# EAGLE design T04_Schematic (EAGLE 7.4.0)
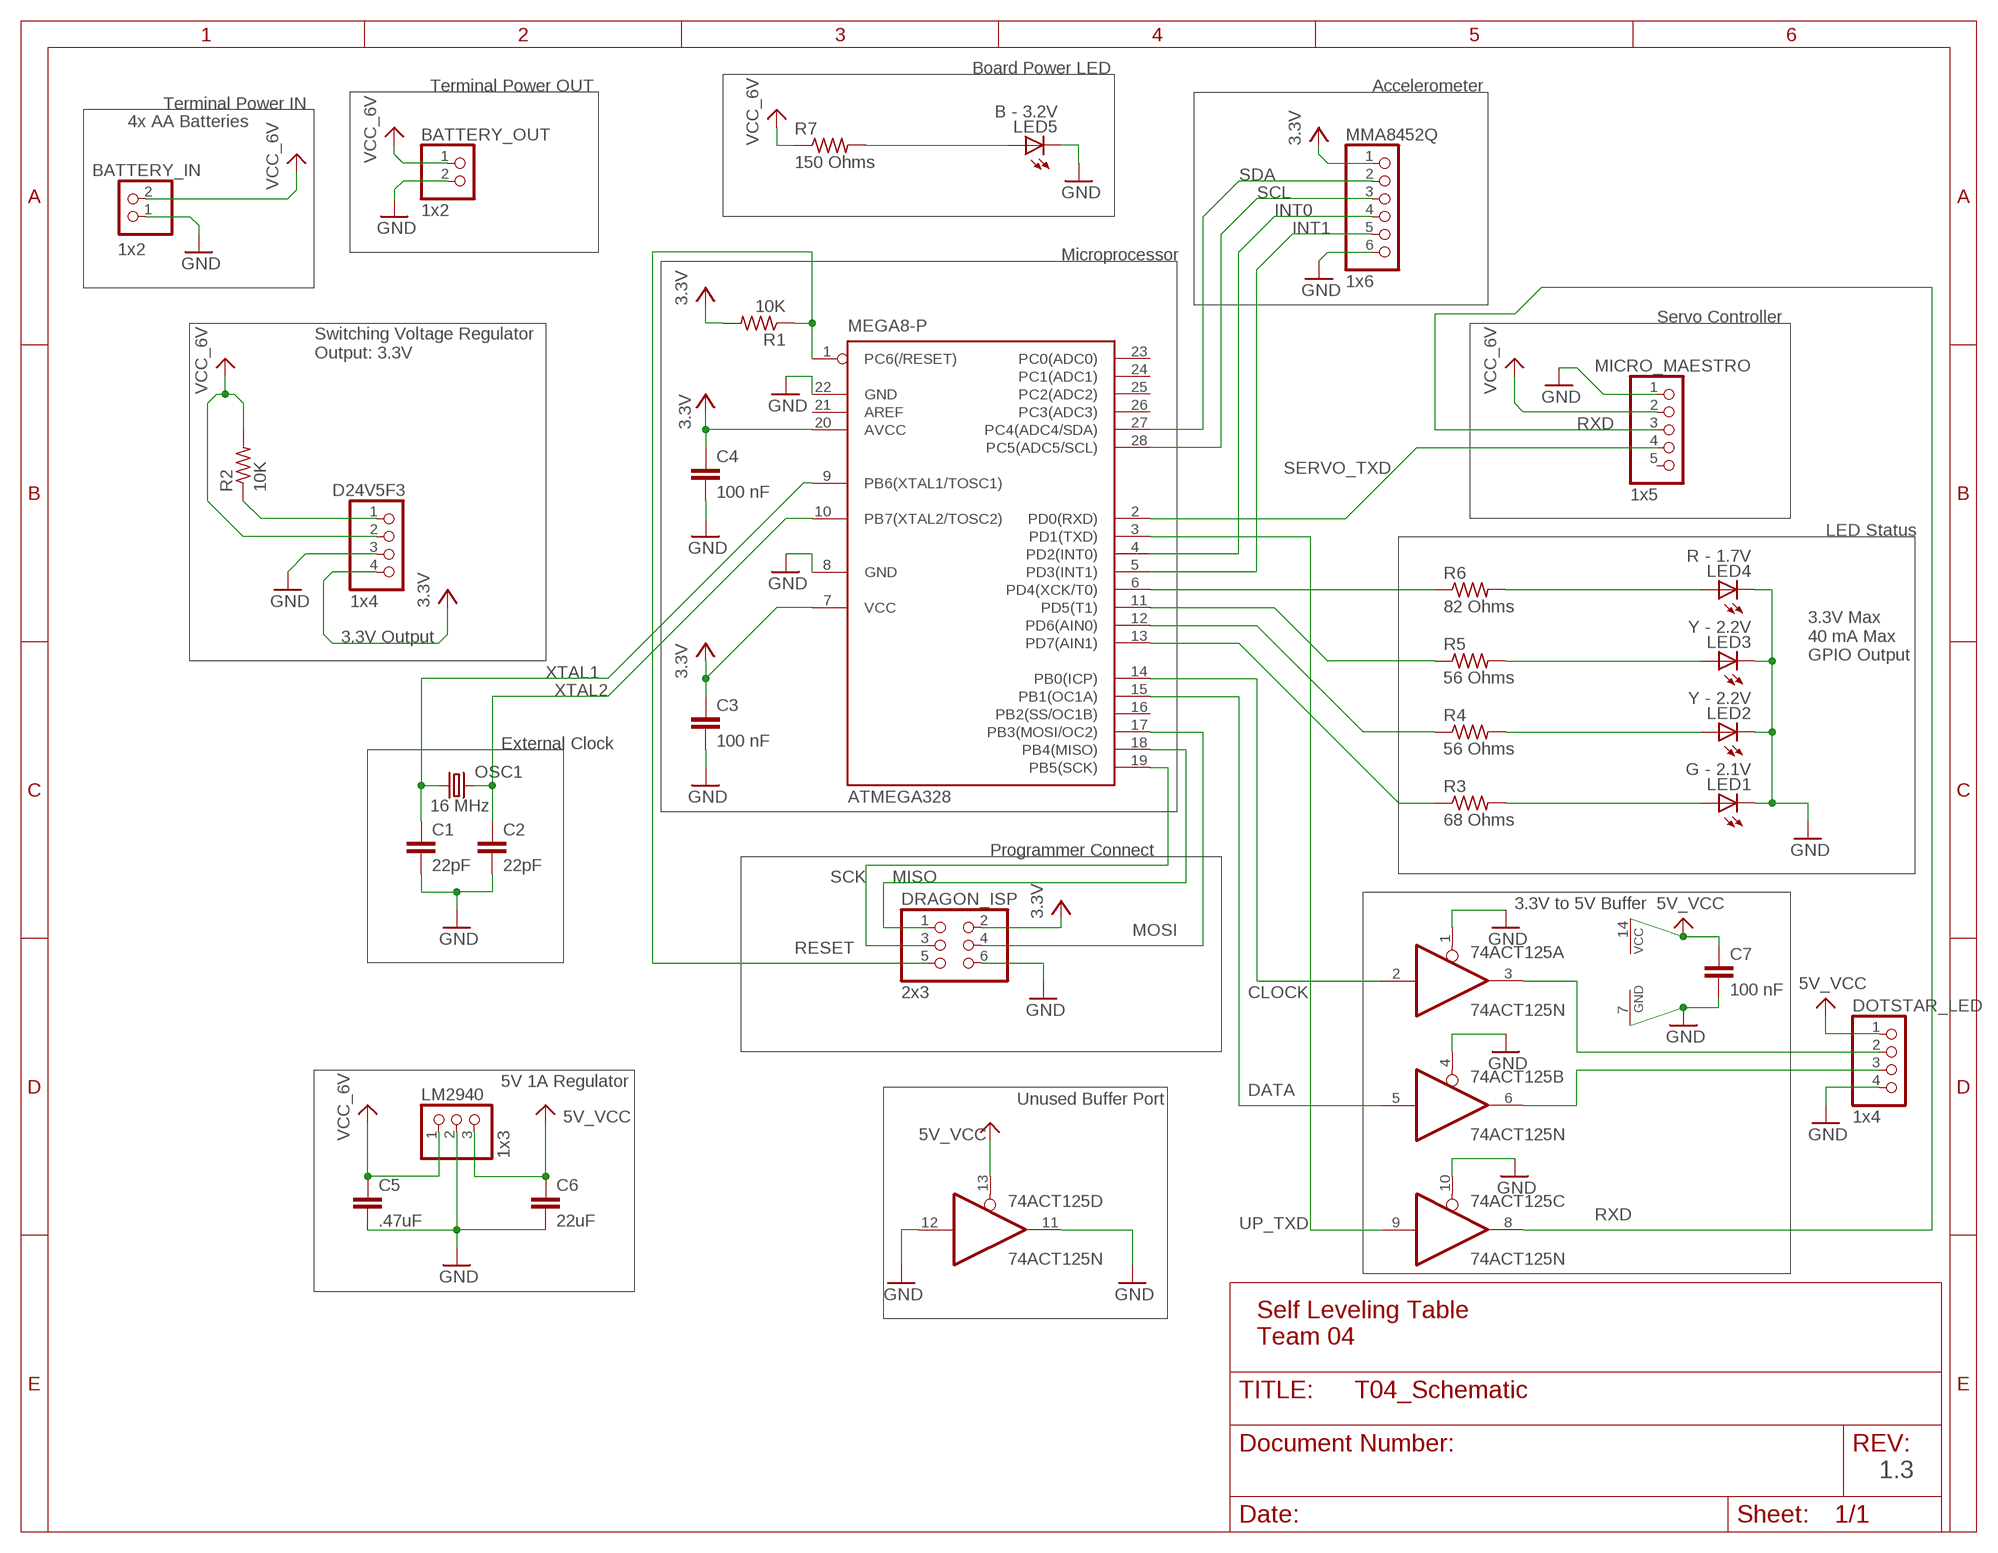
[diagram p0: schematic, sheet 1]

## Parts
74ACT125  74ACT125N  [DIL14]
ATMEGA328  MEGA8-P  [DIL28-3]
BATTERY_IN  1x2  PINHD-1X2  [1X02]
BATTERY_OUT  1x2  PINHD-1X2  [1X02]
C1  22pF  C-EUC1206  [C1206]
C2  22pF  C-EUC1206  [C1206]
C3  100 nF  C-EUC1206  [C1206]
C4  100 nF  C-EUC1206  [C1206]
C5  .47uF  C-EUC1206  [C1206]
C6  22uF  C-EUC1206  [C1206]
C7  100 nF  C-EUC1206  [C1206]
D24V5F3  1x4  PINHD-1X4  [1X04]
DOTSTAR_LED  1x4  PINHD-1X4  [1X04]
DRAGON_ISP  2x3  PINHD-2X3  [2X03]
LED1  G - 2.1V  LEDSMT1206  [1206]
LED2  Y - 2.2V  LEDSMT1206  [1206]
LED3  Y - 2.2V  LEDSMT1206  [1206]
LED4  R - 1.7V  LEDSMT1206  [1206]
LED5  B - 3.2V  LEDSMT1206  [1206]
LM2940  1x3  PINHD-1X3  [1X03]
MICRO_MAESTRO  1x5  PINHD-1X5  [1X05]
MMA8452Q  1x6  PINHD-1X6  [1X06]
OSC1  16 MHz  CRYSTALHC49US  [HC49US]
R1  10K  R-US_M1206  [M1206]
R2  10K  R-US_M1206  [M1206]
R3  68 Ohms  R-US_R1206  [R1206]
R4  56 Ohms  R-US_R1206  [R1206]
R5  56 Ohms  R-US_R1206  [R1206]
R6  82 Ohms  R-US_R1206  [R1206]
R7  150 Ohms  R-US_R1206  [R1206]

## Nets
5V_VCC: 74ACT125.13(D:OE) 74ACT125.14(P:VCC) C6.1 C7.1 DOTSTAR_LED.1 LM2940.3
CLOCK: 74ACT125.2(A:I) ATMEGA328.14(PB0(ICP))
DATA: 74ACT125.5(B:I) ATMEGA328.15(PB1(OC1A))
GND: 74ACT125.1(A:OE) 74ACT125.4(B:OE) 74ACT125.7(P:GND) 74ACT125.10(C:OE) 74ACT125.11(D:O) 74ACT125.12(D:I) ATMEGA328.8(GND) ATMEGA328.22(GND) BATTERY_IN.1 BATTERY_OUT.2 C1.2 C2.2 C3.2 C4.2 C5.2 C6.2 C7.2 D24V5F3.3 DOTSTAR_LED.4 DRAGON_ISP.6 LED1.C LED2.C LED3.C LED4.C LED5.C LM2940.2 MICRO_MAESTRO.1 MMA8452Q.6
INT0: ATMEGA328.4(PD2(INT0)) MMA8452Q.4
INT1: ATMEGA328.5(PD3(INT1)) MMA8452Q.5
MISO: ATMEGA328.18(PB4(MISO)) DRAGON_ISP.1
MOSI: ATMEGA328.17(PB3(MOSI/OC2)) DRAGON_ISP.4
N$1: LED5.A R7.2
N$2: LED1.A R3.2
N$3: LED2.A R4.2
N$4: LED3.A R5.2
N$5: LED4.A R6.2
N$8: 74ACT125.3(A:O) DOTSTAR_LED.2
N$9: ATMEGA328.11(PD5(T1)) R5.1
N$10: ATMEGA328.12(PD6(AIN0)) R4.1
N$11: ATMEGA328.6(PD4(XCK/T0)) R6.1
N$12: ATMEGA328.13(PD7(AIN1)) R3.1
N$13: 74ACT125.6(B:O) DOTSTAR_LED.3
RESET: ATMEGA328.1(PC6(/RESET)) DRAGON_ISP.5 R1.1
RXD: 74ACT125.8(C:O) MICRO_MAESTRO.3
SCK: ATMEGA328.19(PB5(SCK)) DRAGON_ISP.3
SCL: ATMEGA328.28(PC5(ADC5/SCL)) MMA8452Q.3
SDA: ATMEGA328.27(PC4(ADC4/SDA)) MMA8452Q.2
SERVO_TXD: ATMEGA328.2(PD0(RXD)) MICRO_MAESTRO.4
UP_TXD: 74ACT125.9(C:I) ATMEGA328.3(PD1(TXD))
V_REG_RESET: D24V5F3.1 R2.1
VCC: ATMEGA328.7(VCC) ATMEGA328.20(AVCC) C3.1 C4.1 D24V5F3.4 DRAGON_ISP.2 MMA8452Q.1 R1.2 ; supply symbol labelled 3.3V
VCC_6V: BATTERY_IN.2 BATTERY_OUT.1 C5.1 D24V5F3.2 LM2940.1 MICRO_MAESTRO.2 R2.2 R7.1
XTAL1: ATMEGA328.9(PB6(XTAL1/TOSC1)) C1.1 OSC1.1
XTAL2: ATMEGA328.10(PB7(XTAL2/TOSC2)) C2.1 OSC1.2
Unconnected: ATMEGA328.16(PB2(SS/OC1B)) ATMEGA328.21(AREF) ATMEGA328.23(PC0(ADC0)) ATMEGA328.24(PC1(ADC1)) ATMEGA328.25(PC2(ADC2)) ATMEGA328.26(PC3(ADC3)) MICRO_MAESTRO.5

## Notes on the sheet
- Board Power LED
- Terminal Power OUT | Accelerometer
- Terminal Power IN
- 4x AA Batteries
- Microprocessor
- Servo Controller
- Switching Voltage Regulator
  Output: 3.3V
- LED Status
- 3.3V Output
- 3.3V Max
  40 mA Max
  GPIO Output
- External Clock
- Programmer Connect
- 3.3V to 5V Buffer
- 5V 1A Regulator
- Unused Buffer Port
- Self Leveling Table
  Team 04
- 1.3

## Library data of the parts
74ACT125 = 74xx-eu:74*125: Quad bus BUFFER, 3-state
ATMEGA328 = atmel:MEGA8-P: MICROCONTROLLER 8 Kbytes FLASH, 1 kbytes SRAM, 512 bytes EEPROM, USART, 4-channel 10 bit ADC, 2-channel 8 bit ADC Pin compatible with Atmega48, ATMega88, ATMega168 Source: avr.lbr; OC_FARNELL: unknown; OC_NEWARK: unknown
BATTERY_IN BATTERY_OUT = pinhead:PINHD-1X2: PIN HEADER
C1-C7 = rcl:C-EU: CAPACITOR, European symbol
D24V5F3 DOTSTAR_LED = pinhead:PINHD-1X4: PIN HEADER
DRAGON_ISP = pinhead:PINHD-2X3: PIN HEADER
LED1-LED5 = led:LED: LED OSRAM: - CHIPLED LG R971, LG N971, LY N971, LG Q971, LY Q971, LO R971, LY R971 LH N974, LH R974 LS Q976, LO Q976, LY Q976 LO Q996 - Hyper CHIPLED LW Q18S LB Q993, LB Q99A, LB R99A - SideLED LS A670, LO A670, LY A670, LG A670, LP A670 LB A673, LV A673, LT A673, LW A673 LH A674 LY A675 LS A676, LA A676, LO A676, LY A676, LW A676 LS A679, LY A679, LG A679 - Hyper Micro SIDELED® LS Y876, LA Y876, LO Y876, LY Y876 LT Y87S - SmartLED LW L88C, LW L88S LB L89C, LB L89S, LG L890 LS L89K, LO L89K, LY L89K LS L896, LA L896, LO L896, LY L896 - TOPLED LS T670, LO T670, LY T670, LG T670, LP T670 LSG T670, LSP T670, LSY T670, LOP T670, LYG T670 LG T671, LOG T671, LSG T671 LB T673, LV T673, LT T673, LW T673 LH T674 LS T676, LA T676, LO T676, LY T676, LB T676, LH T676, LSB T676, LW T676 LB T67C, LV T67C, LT T67C, LS T67K, LO T67K, LY T67K, LW E67C LS E67B, LA E67B, LO E67B, LY E67B, LB E67C, LV E67C, LT E67C LW T67C LS T679, LY T679, LG T679 LS T770, LO T770, LY T770, LG T770, LP T770 LB T773, LV T773, LT T773, LW T773 LH T774 LS E675, LA E675, LY E675, LS T675 LS T776, LA T776, LO T776, LY T776, LB T776 LHGB T686 LT T68C, LB T68C - Hyper Mini TOPLED® LB M676 - Mini TOPLED Santana® LG M470 LS M47K, LO M47K, LY M47K Source: http://www.osram.convergy.de LUXEON: - LUMILED® LXK2-PW12-R00, LXK2-PW12-S00, LXK2-PW14-U00, LXK2-PW14-V00 LXK2-PM12-R00, LXK2-PM12-S00, LXK2-PM14-U00 LXK2-PE12-Q00, LXK2-PE12-R00, LXK2-PE12-S00, LXK2-PE14-T00, LXK2-PE14-U00 LXK2-PB12-K00, LXK2-PB12-L00, LXK2-PB12-M00, LXK2-PB14-N00, LXK2-PB14-P00, LXK2-PB14-Q00 LXK2-PR12-L00, LXK2-PR12-M00, LXK2-PR14-Q00, LXK2-PR14-R00 LXK2-PD12-Q00, LXK2-PD12-R00, LXK2-PD12-S00 LXK2-PH12-R00, LXK2-PH12-S00 LXK2-PL12-P00, LXK2-PL12-Q00, LXK2-PL12-R00 Source: www.luxeon.com KINGBRIGHT: KA-3528ASYC Source: www.kingbright.com
LM2940 = pinhead:PINHD-1X3: PIN HEADER
MICRO_MAESTRO = pinhead:PINHD-1X5: PIN HEADER
MMA8452Q = pinhead:PINHD-1X6: PIN HEADER
OSC1 = SparkFun-FreqCtrl:CRYSTAL: Various standard crystals. Proven footprints.
R1-R7 = rcl:R-US_: RESISTOR, American symbol

## Board
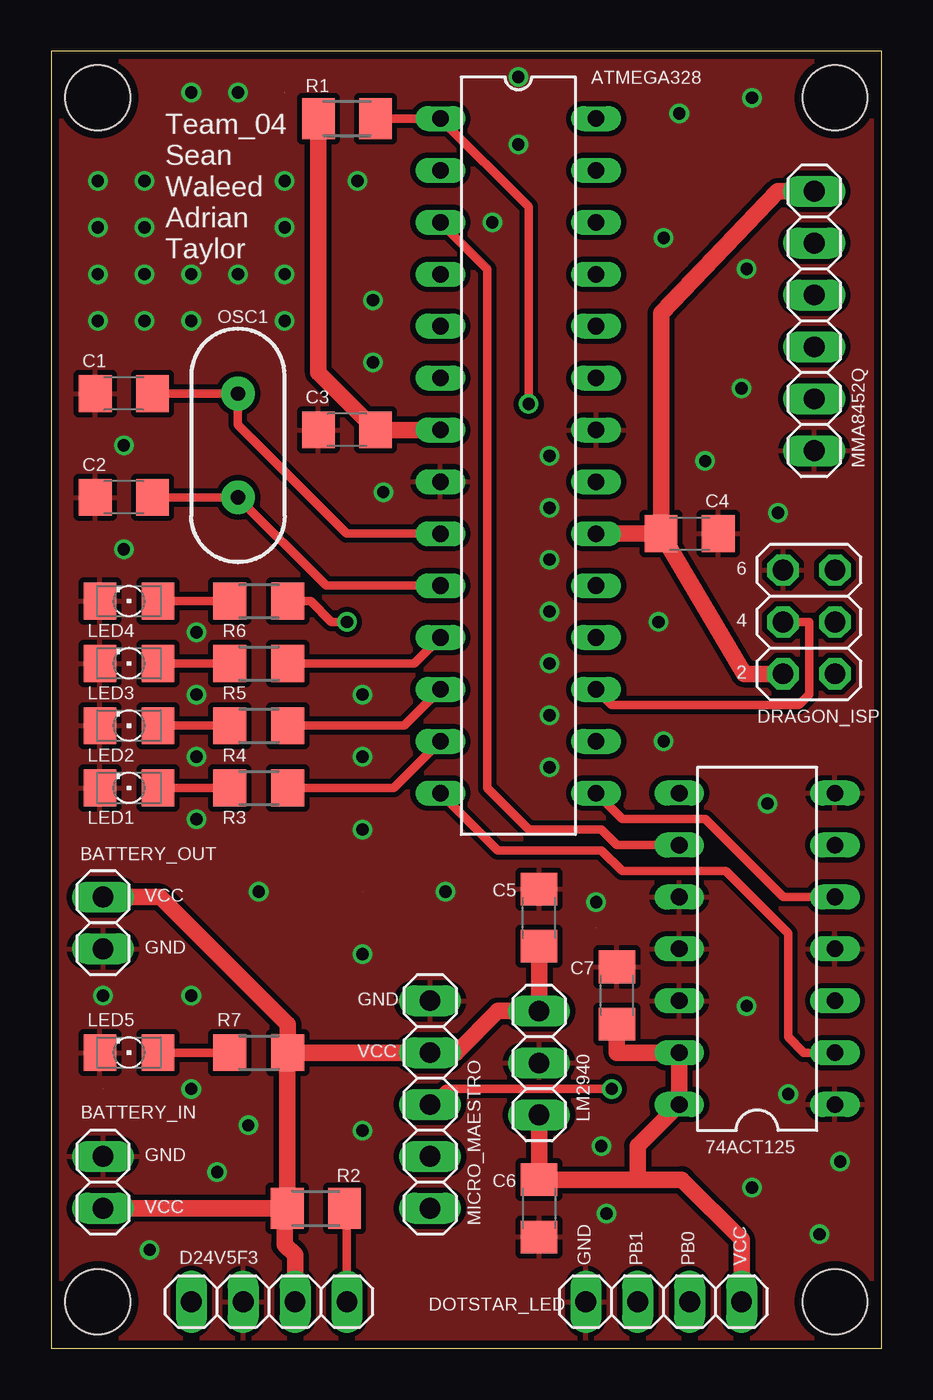
[diagram p1: board, top side]
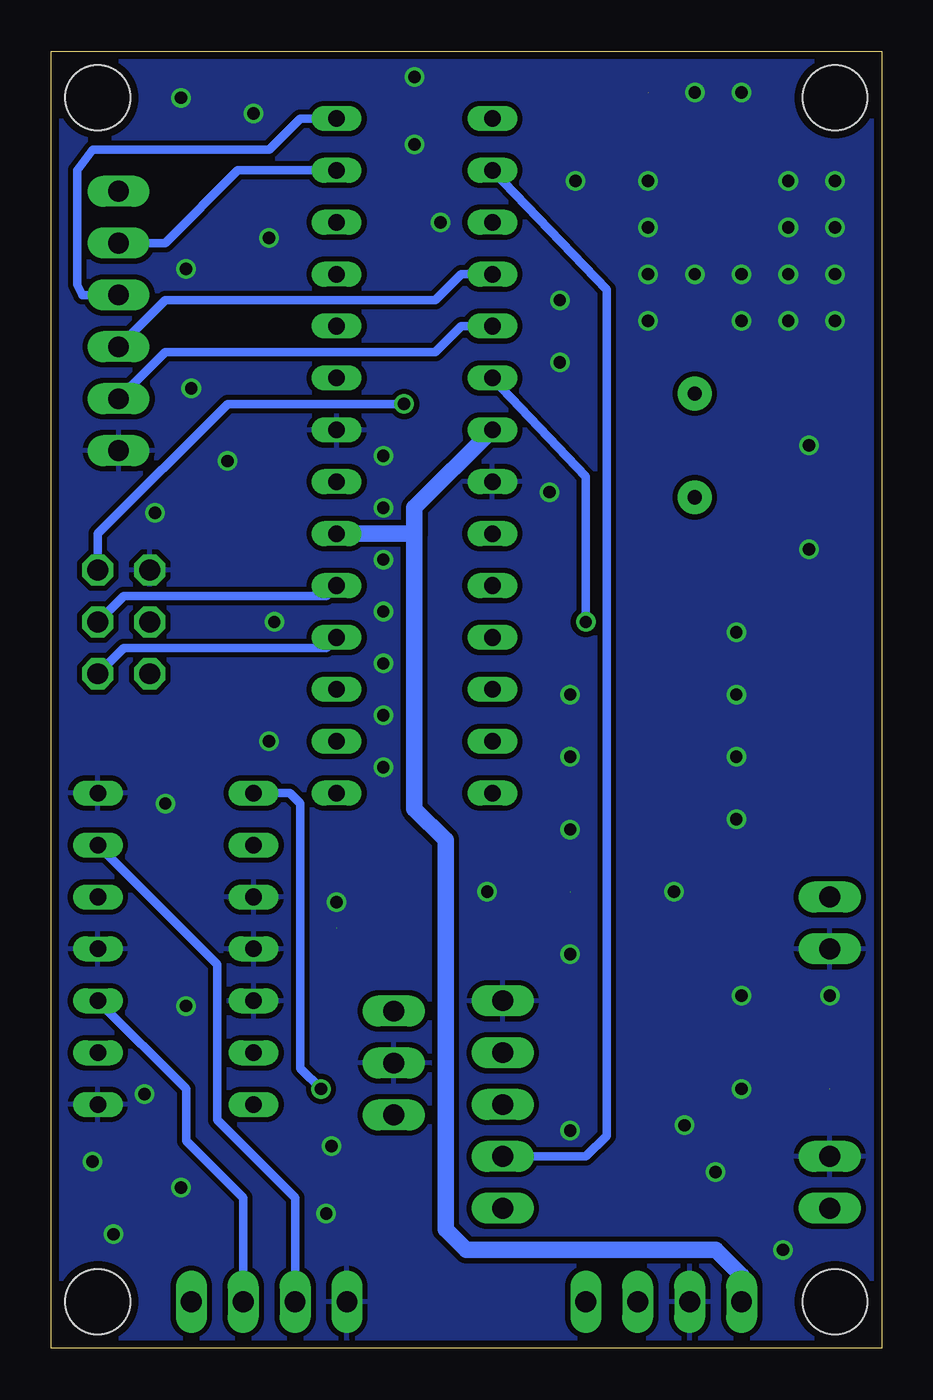
[diagram p2: board, bottom side, seen from below]

Size 40.64 x 63.5 mm. Coordinates in mm from the lower left corner, seen from the top.
Outline: 0,0 40.64,0 40.64,63.5 0,63.5 0,0
Copper layers (1*16): Top 0.0356mm / dielectric 1.5011mm / Bottom 0.0356mm
Design rules "LaenPCBOrder": minimum track width 6mil, minimum drill 13mil, track to track 6mil, track to pad 6mil, pad to pad 6mil, via to via 6mil, smd to smd 6mil, copper to edge 15mil, drill to drill 6mil, minimum pad ring 7mil, minimum via ring 7mil, stop-mask expansion 3mil, vias tented up to drill 0mil, thermal gap 10mil
Holes 3.17 mm at 2.29,61.21 38.35,61.21 2.29,2.29 38.35,2.29

### Footprints (pad centres in the part's own frame; a part is rotated, then mirrored left to right if it is on the bottom)
DIL14 = drill 0.813 long: 1 -7.62,-3.81; 2 -5.08,-3.81; 3 -2.54,-3.81; 4 0,-3.81; 5 2.54,-3.81; 6 5.08,-3.81; 7 7.62,-3.81; 8 7.62,3.81; 9 5.08,3.81; 10 2.54,3.81; 11 0,3.81; 12 -2.54,3.81; 13 -5.08,3.81; 14 -7.62,3.81
DIL28-3 = drill 0.813 long: 1 -16.51,-3.81; 2 -13.97,-3.81; 3 -11.43,-3.81; 4 -8.89,-3.81; 5 -6.35,-3.81; 6 -3.81,-3.81; 7 -1.27,-3.81; 8 1.27,-3.81; 9 3.81,-3.81; 10 6.35,-3.81; 11 8.89,-3.81; 12 11.43,-3.81; 13 13.97,-3.81; 14 16.51,-3.81; 15 16.51,3.81; 16 13.97,3.81; 17 11.43,3.81; 18 8.89,3.81; 19 6.35,3.81; 20 3.81,3.81; 21 1.27,3.81; 22 -1.27,3.81; 23 -3.81,3.81; 24 -6.35,3.81; 25 -8.89,3.81; 26 -11.43,3.81; 27 -13.97,3.81; 28 -16.51,3.81
1X02 = drill 1.016 long: 1 -1.27,0; 2 1.27,0
C1206 = smd 1.6 x 1.8: 1 -1.4,0; 2 1.4,0
1X04 = drill 1.016 long: 1 -3.81,0; 2 -1.27,0; 3 1.27,0; 4 3.81,0
2X03 = drill 1.016 octagon: 1 -2.54,-1.27; 2 -2.54,1.27; 3 0,-1.27; 4 0,1.27; 5 2.54,-1.27; 6 2.54,1.27
1206 = smd 1.6 x 1.803: A -1.422,0; C 1.422,0
1X03 = drill 1.016 long: 1 -2.54,0; 2 0,0; 3 2.54,0
1X05 = drill 1.016 long: 1 -5.08,0; 2 -2.54,0; 3 0,0; 4 2.54,0; 5 5.08,0
1X06 = drill 1.016 long: 1 -6.35,0; 2 -3.81,0; 3 -1.27,0; 4 1.27,0; 5 3.81,0; 6 6.35,0
HC49US = drill 0.7 pad 1.651: 1 -2.54,0; 2 2.54,0
M1206 = smd 1.6 x 2: 1 -1.4,0; 2 1.4,0
R1206 = smd 1.6 x 1.803: 1 -1.422,0; 2 1.422,0

### Placement (x,y rotation side)
74ACT125  34.54,19.56 90 top
ATMEGA328  22.86,43.69 270 top
BATTERY_IN  2.54,8.13 270 top
BATTERY_OUT  2.54,20.83 270 top
C1  3.56,46.74 180 top
C2  3.56,41.66 180 top
C3  14.48,44.96 180 top
C4  31.24,39.88 0 top
C5  23.88,21.08 90 top
C6  23.88,6.86 270 top
C7  27.69,17.27 90 top
D24V5F3  10.67,2.29 180 top
DOTSTAR_LED  29.97,2.29 180 top
DRAGON_ISP  37.08,35.56 90 top
LED1  3.81,27.43 180 top
LED2  3.81,30.48 180 top
LED3  3.81,33.53 180 top
LED4  3.81,36.58 180 top
LED5  3.81,14.48 180 top
LM2940  23.88,13.97 270 top
MICRO_MAESTRO  18.54,11.94 270 top
MMA8452Q  37.34,50.29 270 top
OSC1  9.14,44.2 270 top
R1  14.48,60.2 180 top
R2  12.95,6.86 180 top
R3  10.16,27.43 180 top
R4  10.16,30.48 180 top
R5  10.16,33.53 180 top
R6  10.16,36.58 180 top
R7  10.16,14.48 180 top

### Tracks (layer width: path | path; a pad name or v marks a point on that pad's centre or on a via)
5V_VCC
  Top 0.813: LM2940.3 C6.1 28.7,8.26 | 28.7,8.26 30.86,8.26 33.78,5.33 DOTSTAR_LED.1 | 28.7,8.26 28.7,9.91 74ACT125.14 74ACT125.13 27.69,14.48 C7.1
CLOCK
  Top 0.406: 74ACT125.2 36.83,14.48 36.07,15.24 36.07,20.32 33.02,23.37 27.94,23.37 26.92,24.38 21.84,24.38 ATMEGA328.14
DATA
  Top 0.406: 74ACT125.5 35.81,22.1 32,25.91 27.94,25.91 ATMEGA328.15
GND  (via drill 0.6)  (4 unrouted)
  other vias: 2.29,57.15 2.29,54.86 2.29,52.58 2.29,50.29 4.57,50.29 4.57,52.58 4.57,54.86 4.57,57.15 6.86,52.58 9.14,52.58 11.43,52.58 6.86,50.29 11.43,54.86 11.43,57.15 6.86,61.47 9.14,61.47 11.43,50.29 3.56,44.2 3.56,39.12 7.11,35.05 7.11,32 7.11,28.96 7.11,25.91 2.54,17.27 6.86,17.27 6.86,12.7 8.13,8.64 4.83,4.83 9.65,10.92 27.18,6.6 26.92,9.91 37.59,5.59 10.16,22.35 19.3,22.35 24.38,41.15 32,43.43 29.72,35.56 33.78,46.99 29.97,54.36 30.73,60.45 34.29,61.21 22.86,62.23 22.86,58.93 14.99,57.15 15.75,48.26 15.75,51.31 16.26,41.91 15.24,32 15.24,28.96 15.24,25.4 15.24,10.67 15.24,19.3 24.38,38.61 24.38,36.07 24.38,33.53 24.38,30.99 24.38,43.69 24.38,28.45 29.97,29.72 35.56,40.89 34.04,52.83 21.59,55.12 35.05,26.67 34.04,16.76 38.61,9.14 26.67,21.84 34.29,7.87 36.07,12.45
  pour Bottom (isolate 0.254): 0,63.5 40.64,63.5 40.64,0 0,0
  pour Top (isolate 0.254): 0,63.5 40.64,63.5 40.64,0 0,0
INT0
  Bottom 0.406: MMA8452Q.4 35.05,51.31 21.84,51.31 20.57,52.58 ATMEGA328.4
INT1
  Bottom 0.406: MMA8452Q.5 35.05,48.77 21.84,48.77 20.57,50.04 ATMEGA328.5
MISO
  Bottom 0.406: ATMEGA328.18 27.18,34.29 37.08,34.29 DRAGON_ISP.1
MOSI
  Top 0.406: DRAGON_ISP.4 37.08,35.56 37.08,32 36.58,31.5 27.43,31.5 ATMEGA328.17
N$1
  Top 0.406: LED5.A R7.2
N$2
  Top 0.406: LED1.A R3.2
N$3
  Top 0.406: LED2.A R4.2
N$4
  Top 0.406: LED3.A R5.2
N$5
  Top 0.406: LED4.A R6.2
N$8
  Bottom 0.406: 74ACT125.3 34.04,12.7 34.04,10.16 31.24,7.37 DOTSTAR_LED.2
N$9
  Top 0.406: R5.1 17.78,33.53 ATMEGA328.11
N$10
  Top 0.406: R4.1 17.27,30.48 ATMEGA328.12
N$11  (via drill 0.6)
  Top 0.406: R6.1 12.7,36.58 13.72,35.56 v14.48,35.56
  Bottom 0.406: v14.48,35.56 14.48,42.67 ATMEGA328.6
N$12
  Top 0.406: R3.1 16.76,27.43 ATMEGA328.13
N$13
  Bottom 0.406: 74ACT125.6 32.51,18.8 32.51,11.18 28.7,7.37 DOTSTAR_LED.3
RESET  (via drill 0.6)
  Top 0.406: R1.1 ATMEGA328.1 23.37,55.88 v23.37,46.23
  Bottom 0.406: v23.37,46.23 32,46.23 38.35,39.88 DRAGON_ISP.5
RXD  (via drill 0.6)
  Top 0.406: v27.43,12.7 19.3,12.7 MICRO_MAESTRO.3
  Bottom 0.406: 74ACT125.8 28.96,27.18 28.45,26.67 28.45,13.72 v27.43,12.7
SCK
  Bottom 0.406: ATMEGA328.19 27.18,36.83 37.08,36.83 DRAGON_ISP.3
SCL
  Bottom 0.406: MMA8452Q.3 39.12,51.56 39.37,52.07 39.37,57.66 38.61,58.67 29.97,58.67 28.45,60.2 ATMEGA328.28
SDA
  Bottom 0.406: ATMEGA328.27 31.5,57.66 35.05,54.1 MMA8452Q.2
SERVO_TXD
  Bottom 0.406: ATMEGA328.2 13.46,51.82 13.46,10.41 14.48,9.4 MICRO_MAESTRO.4
UP_TXD
  Top 0.406: 74ACT125.9 27.69,24.64 26.92,25.4 23.37,25.4 21.34,27.43 21.34,52.83 ATMEGA328.3
V_REG_RESET
  Top 0.406: R2.1 14.48,6.73 D24V5F3.1
VCC
  Top 0.813: ATMEGA328.7 C3.1 13.08,47.76 R1.2 | ATMEGA328.20 C4.1 | C4.1 33.91,33.02 DRAGON_ISP.2 | C4.1 29.84,50.67 35.56,56.64 MMA8452Q.1
  Bottom 0.813: 22.86,39.88 22.86,26.42 21.34,24.89 21.34,5.84 20.32,4.83 8.13,4.83 6.86,3.56 D24V5F3.4 | 22.86,39.88 ATMEGA328.20 | ATMEGA328.7 22.86,41.15 22.86,39.88
VCC_6V
  Top 0.813: R2.2 11.56,14.46 R7.1 | R7.1 MICRO_MAESTRO.2 19.81,14.48 21.84,16.51 LM2940.1 C5.1 | R7.1 11.58,15.85 5.33,22.1 BATTERY_OUT.1 | R2.2 BATTERY_IN.2 | R2.2 11.43,6.73 11.43,5.08 11.94,4.57 D24V5F3.2
XTAL1
  Top 0.406: C1.1 OSC1.1 9.14,45.21 14.48,39.88 ATMEGA328.9
XTAL2
  Top 0.406: C2.1 OSC1.2 13.46,37.34 ATMEGA328.10

### Text on the board
tPlace: Team_04 / Sean / Waleed / Adrian / Taylor | 6 | 4 | 2 | VCC | GND | GND | VCC | GND | VCC | GND | PB1 | PB0 | VCC